# Altium schematic sheet Bank1_I_O.SchDoc
size A3
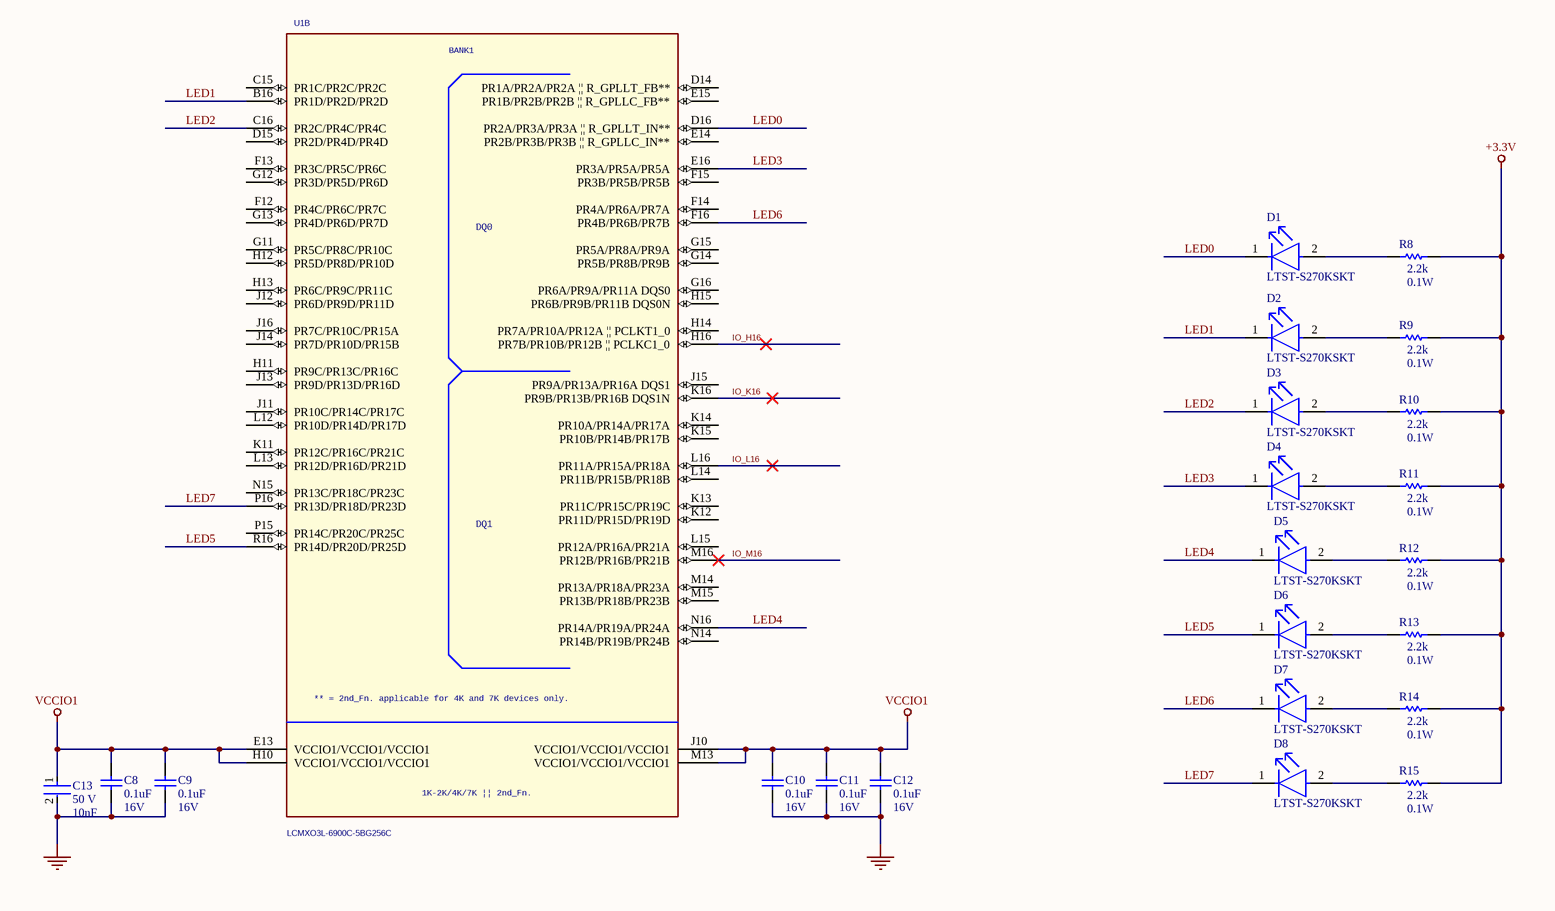
[diagram p0: Bank1_I_O.SchDoc]

## Parts
C8  value 0.1uF  Voltage: 16V  [CAPC1608X87X35ML15T15]  (hidden comment: C0603C104M4RACTU)
C9  value 0.1uF  Voltage: 16V  [CAPC1608X87X35ML15T15]  (hidden comment: C0603C104M4RACTU)
C10  value 0.1uF  Voltage: 16V  [CAPC1608X87X35ML15T15]  (hidden comment: C0603C104M4RACTU)
C11  value 0.1uF  Voltage: 16V  [CAPC1608X87X35ML15T15]  (hidden comment: C0603C104M4RACTU)
C12  value 0.1uF  Voltage: 16V  [CAPC1608X87X35ML15T15]  (hidden comment: C0603C104M4RACTU)
C13  value 10nF  Voltage: 50 V  [FP-C0805C-DN-MFG]  (hidden comment: C0805C103K5RACAUTO)
D1  LTST-S270KSKT  [FP-LTST-S270KSKT-MFG]
D2  LTST-S270KSKT  [FP-LTST-S270KSKT-MFG]
D3  LTST-S270KSKT  [FP-LTST-S270KSKT-MFG]
D4  LTST-S270KSKT  [FP-LTST-S270KSKT-MFG]
D5  LTST-S270KSKT  [FP-LTST-S270KSKT-MFG]
D6  LTST-S270KSKT  [FP-LTST-S270KSKT-MFG]
D7  LTST-S270KSKT  [FP-LTST-S270KSKT-MFG]
D8  LTST-S270KSKT  [FP-LTST-S270KSKT-MFG]
R8  value 2.2k  Power: 0.1W  [RESC1608X55X25LL10T15]  (hidden comment: RC0603FR-072K2L)
R9  value 2.2k  Power: 0.1W  [RESC1608X55X25LL10T15]  (hidden comment: RC0603FR-072K2L)
R10  value 2.2k  Power: 0.1W  [RESC1608X55X25LL10T15]  (hidden comment: RC0603FR-072K2L)
R11  value 2.2k  Power: 0.1W  [RESC1608X55X25LL10T15]  (hidden comment: RC0603FR-072K2L)
R12  value 2.2k  Power: 0.1W  [RESC1608X55X25LL10T15]  (hidden comment: RC0603FR-072K2L)
R13  value 2.2k  Power: 0.1W  [RESC1608X55X25LL10T15]  (hidden comment: RC0603FR-072K2L)
R14  value 2.2k  Power: 0.1W  [RESC1608X55X25LL10T15]  (hidden comment: RC0603FR-072K2L)
R15  value 2.2k  Power: 0.1W  [RESC1608X55X25LL10T15]  (hidden comment: RC0603FR-072K2L)
U1  LCMXO3L-6900C-5BG256C  [BGA256C80P16X16_1400X1400X170]  (part B of 7)

## Nets
+3.3V: R8.2 R9.2 R10.2 R11.2 R12.2 R13.2 R14.2 R15.2
GND: C8.2 C9.2 C10.2 C11.2 C12.2 C13.2
VCCIO1: C8.1 C9.1 C10.1 C11.1 C12.1 C13.1 U1.E13(VCCIO1/VCCIO1/VCCIO1) U1.H10(VCCIO1/VCCIO1/VCCIO1) U1.J10(VCCIO1/VCCIO1/VCCIO1) U1.M13(VCCIO1/VCCIO1/VCCIO1)
IO_H16: U1.H16(PR7B/PR10B/PR12B_||_PCLKC1_0)
IO_K16: U1.K16(PR9B/PR13B/PR16B_DQS1N)
IO_L16: U1.L16(PR11A/PR15A/PR18A)
IO_M16: U1.M16(PR12B/PR16B/PR21B)
LED0: D1.1(C) U1.D16(PR2A/PR3A/PR3A_||_R_GPLLT_IN**)
LED1: D2.1(C) U1.B16(PR1D/PR2D/PR2D)
LED2: D3.1(C) U1.C16(PR2C/PR4C/PR4C)
LED3: D4.1(C) U1.E16(PR3A/PR5A/PR5A)
LED4: D5.1(C) U1.N16(PR14A/PR19A/PR24A)
LED5: D6.1(C) U1.R16(PR14D/PR20D/PR25D)
LED6: D7.1(C) U1.F16(PR4B/PR6B/PR7B)
LED7: D8.1(C) U1.P16(PR13D/PR18D/PR23D)
NetD1_2: D1.2(A) R8.1
NetD2_2: D2.2(A) R9.1
NetD3_2: D3.2(A) R10.1
NetD4_2: D4.2(A) R11.1
NetD5_2: D5.2(A) R12.1
NetD6_2: D6.2(A) R13.1
NetD7_2: D7.2(A) R14.1
NetD8_2: D8.2(A) R15.1

Not connected (* = marked no-connect by the designer): U1 C15(PR1C/PR2C/PR2C) D14(PR1A/PR2A/PR2A_||_R_GPLLT_FB**) D15(PR2D/PR4D/PR4D) E14(PR2B/PR3B/PR3B_||_R_GPLLC_IN**) E15(PR1B/PR2B/PR2B_||_R_GPLLC_FB**) F12(PR4C/PR6C/PR7C) F13(PR3C/PR5C/PR6C) F14(PR4A/PR6A/PR7A) F15(PR3B/PR5B/PR5B) G11(PR5C/PR8C/PR10C) G12(PR3D/PR5D/PR6D) G13(PR4D/PR6D/PR7D) G14(PR5B/PR8B/PR9B) G15(PR5A/PR8A/PR9A) G16(PR6A/PR9A/PR11A_DQS0) H11(PR9C/PR13C/PR16C) H12(PR5D/PR8D/PR10D) H13(PR6C/PR9C/PR11C) H14(PR7A/PR10A/PR12A_||_PCLKT1_0) H15(PR6B/PR9B/PR11B_DQS0N) J11(PR10C/PR14C/PR17C) J12(PR6D/PR9D/PR11D) J13(PR9D/PR13D/PR16D) J14(PR7D/PR10D/PR15B) J15(PR9A/PR13A/PR16A_DQS1) J16(PR7C/PR10C/PR15A) K11(PR12C/PR16C/PR21C) K12(PR11D/PR15D/PR19D) K13(PR11C/PR15C/PR19C) K14(PR10A/PR14A/PR17A) K15(PR10B/PR14B/PR17B) L12(PR10D/PR14D/PR17D) L13(PR12D/PR16D/PR21D) L14(PR11B/PR15B/PR18B) L15(PR12A/PR16A/PR21A) M14(PR13A/PR18A/PR23A) M15(PR13B/PR18B/PR23B) N14(PR14B/PR19B/PR24B) N15(PR13C/PR18C/PR23C) P15(PR14C/PR20C/PR25C)

## Notes on the sheet
- Title
- Size:
- Date:
- A3
- Number:
- Time:
- Revision:
- Sheet
- of
- File:
- (in symbol LCMXO3L-1K/2K/4K/7K-BG256, part B) BANK1; DQ0; DQ1; ** = 2nd_Fn. applicable for 4K and 7K devices only.; 1K-2K/4K/7K || 2nd_Fn.

## Library data of the parts
C8-C12 = CMP-2006-03067-1: Ceramic Capacitor 0.1uF 16V +-10% X7R0603; Manufacturer: Kemet; Alternative1: C1608X7R1E104K TDK; Alternative2: CC0603KRX7R8BB104 Yageo; Alternative3: GRM188R72A104KA35D Murata; Part Number: C0603C104M4RACTU; Package / Case: 0603
C13 = CMP-03020-006206-1: CAP CER 10000PF 50V X7R 0805; Manufacturer: KEMET; Material: Ceramic; Temperature Coefficient: 30ppm/°C; Alternative1: GRM21BR72A103KA01L Murata; Alternative2: C0805F103K5RACTU KEMET; Alternative3: 08055C103JAT2A Kyocera AVX; Height: 0.88mm; Temperature Characteristic: X7R; Part Number: C0805C103K5RACAUTO; ComponentLink2URL: https://content.kemet.com/datasheets/KEM_C1003_C0G_SMD.pdf; RoHS: TRUE; Temperature: -55°C to +125°C; Temperature Range Low: -55°C; ComponentLink2Description: Datasheet; Package / Case: C0805C-DN; Lead Free: Yes
D1-D8 = CMP-22017-000015-1: LED YELLOW CLEAR CHIP SMD R/A; Wavelength: 591nm; Lens Color: Colorless; Dominant Wavelength: 587nm; Reverse Voltage: 5V; Test Current: 20mA; Forward Current: 30mA; Power Dissipation: 75mW; Number of Elements: 1; Viewing Angle: 130°; Forward Voltage: 2V; Lens Style: Diffused; Luminous Intensity: 80mcd; Max Operating Temperature: 85°C; Lead Free: Lead Free; Case Code (Metric): 1608; Number of Pins: 2; Package Quantity: 1; Height: 0.6mm; Illumination Color: Yellow; Mount: Surface Mount; Case Code (Imperial): 0603; Length: 1.6mm; Packaging: Tape and Reel; Radiation Hardening: No; Width: 1.15mm; Depth: 0.6mm; Lens Transparency: Clear; Case/Package: 0603; Number of LEDs: 1; Power Rating: 75mW; Color: Yellow; Min Operating Temperature: -55°C
R8-R15 = CMP-2000-06934-1: Thick Film Resistor, 2.2 KOhm, 100 mW, 50 V, +/- 1%, -55 to 155 degC, 2-Pin SMD (0603), RoHS, Tape and Reel; Manufacturer: Yageo; Temperature Coefficient: 100PPM/C; Voltage: 50V; Alternative1: RC0603FR-102K2L Yageo; Alternative2: RMCF0603FT2K20 Stackpole Electronics; Alternative3: CRCW06032K20FKEA Vishay; Tolerance: 1%; Datasheet Version: Rev. 7, 05/2017; Case Code - mm: 1608; Series: RC; Mounting Technology: SurfaceMount; Package Description: 2-Pin Surface Mount Device, Body 1.6 x 0.8 mm; Package / Case: 0603; Package Reference: 0603; Product: ThickFilmResistorsGeneralPurpose; Manufacturer URL: http://www.yageo.com/; Termination Style: SMD/SMT; Operating Temperature Range: -55Cto+155C; Datasheet URL: http://www.yageo.com/documents/recent/PYu-RC_Group_51_RoHS_L_7.pdf; Packaging: Reel
U1 = LCMXO3L-1K/2K/4K/7K-BG256: IC FPGA 6864LUTS 256BGA; Manufacturer: Lattice semi; SPLIT_INST: TRUE; SWAP_INFO: (S1+S2+S3+S4+S5+S6+S7); Graphic: LCMXO3L-1K/2K/4K/7K-BG256A.Normal; Power Pins Visible: False; Source Library: D:\DESIGN_DOC\XO3\LATTICEORCADCAPTURESCHEMATICLIBRARYOLB\LATTICEORCADCAPTURESCHEMATICLIBRARYOLB\LATTICE_SYM\LATTICEPLDS.OLB; Location Y-Coordinate: 0; Implementation Type: <none>; Primitive: DEFAULT; Name: I16790692; Digikey P/N: 220-1886-ND; Source Package: LCMXO3L-1K/2K/4K/7K-BG256; Source Part: LCMXO3L-1K/2K/4K/7K-BG256A.Normal; Color: Default; Location X-Coordinate: 0; Manufacturer Part Number: LCMXO3L-6900C-5BG256C